# EAGLE design headstage-64-coax-adapter rev2.0 (EAGLE 9.5.1)
DESIGNER: Jon Newman; DESIGN_NAME: Headstage-64 Coax Adapter; LICENSE: CERN OHL v1.2; REVISION: 1.0
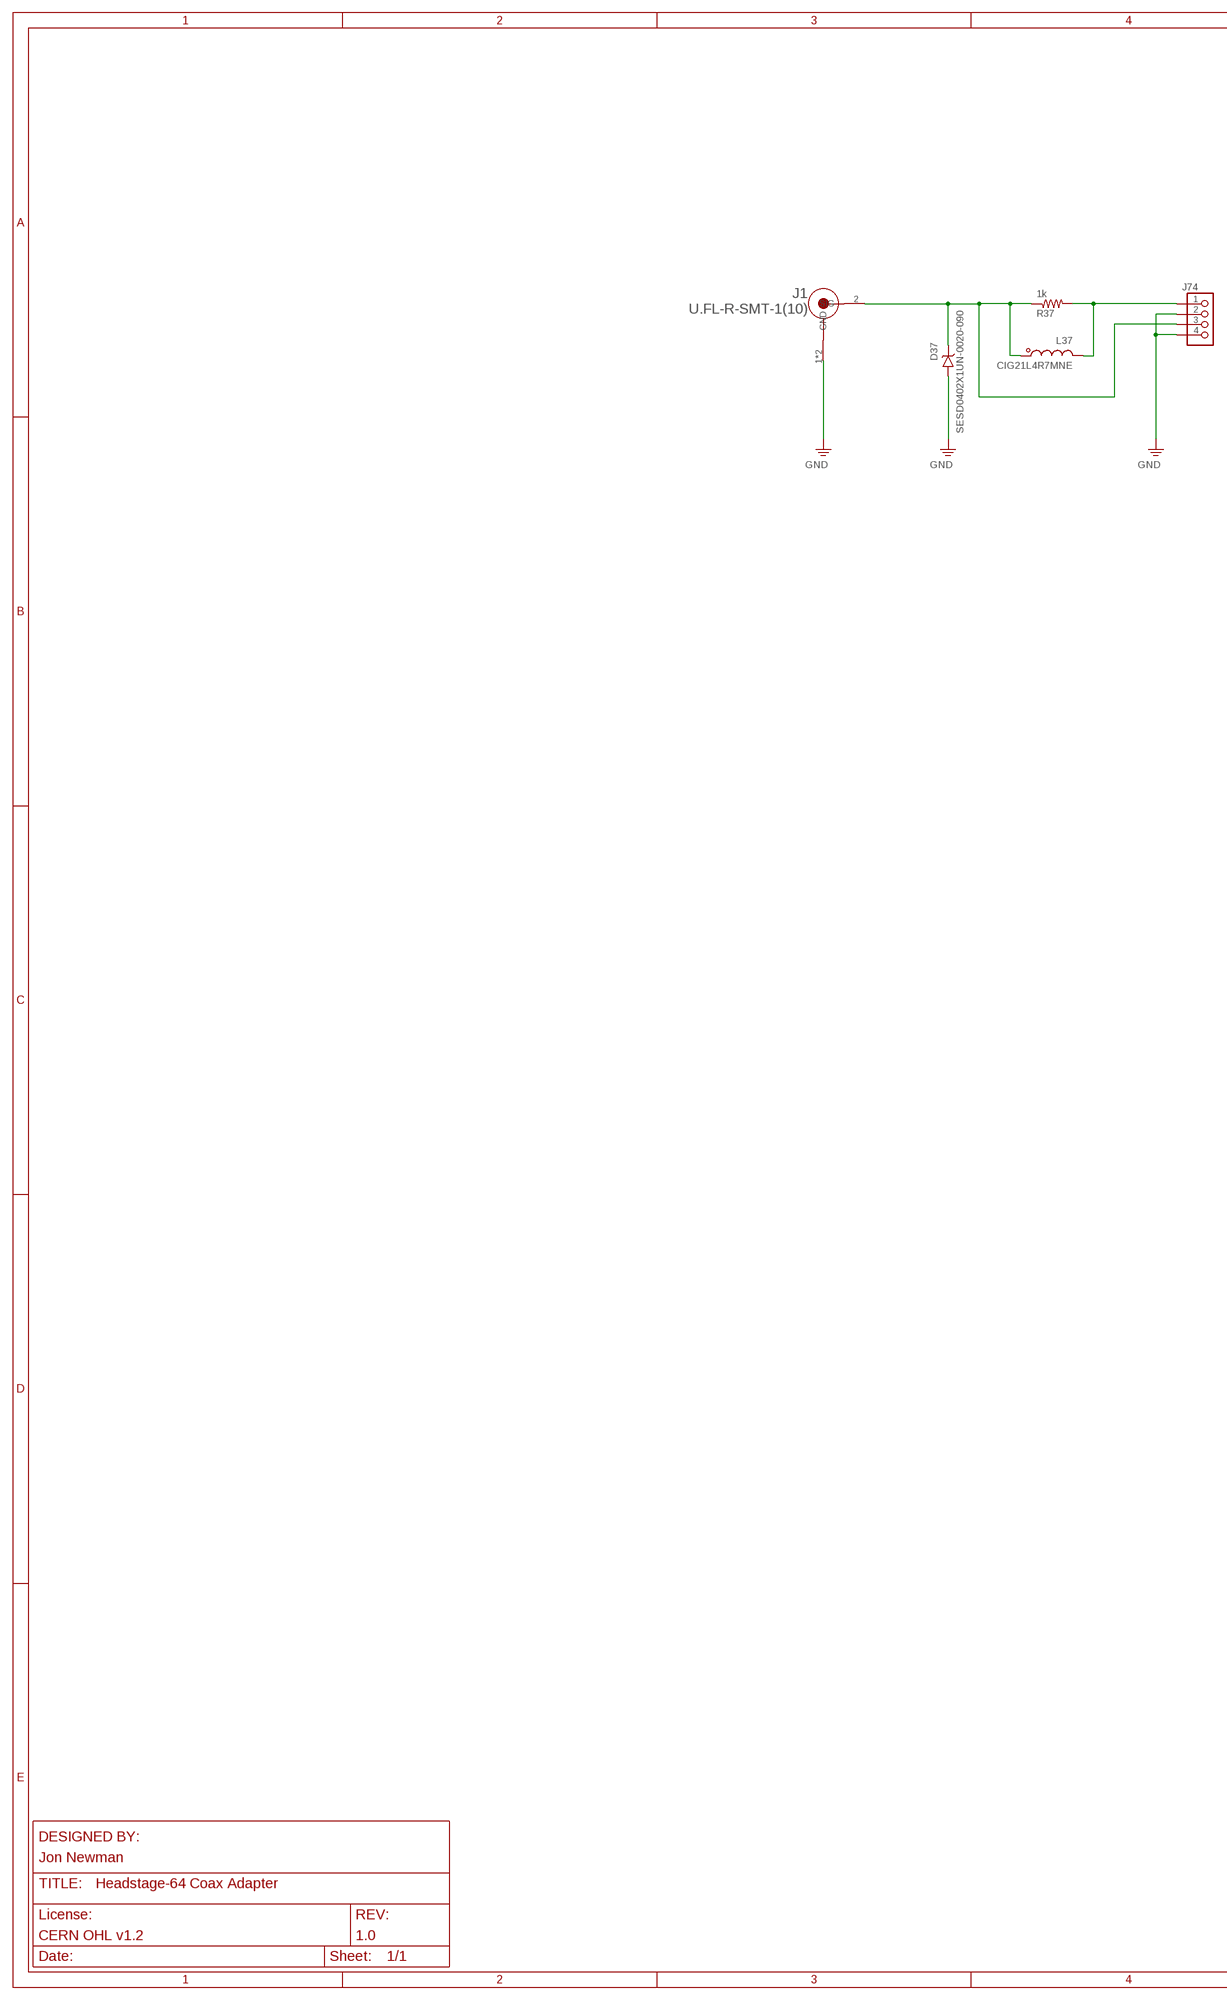
[diagram p0: schematic, sheet 1, part 1 of 2]
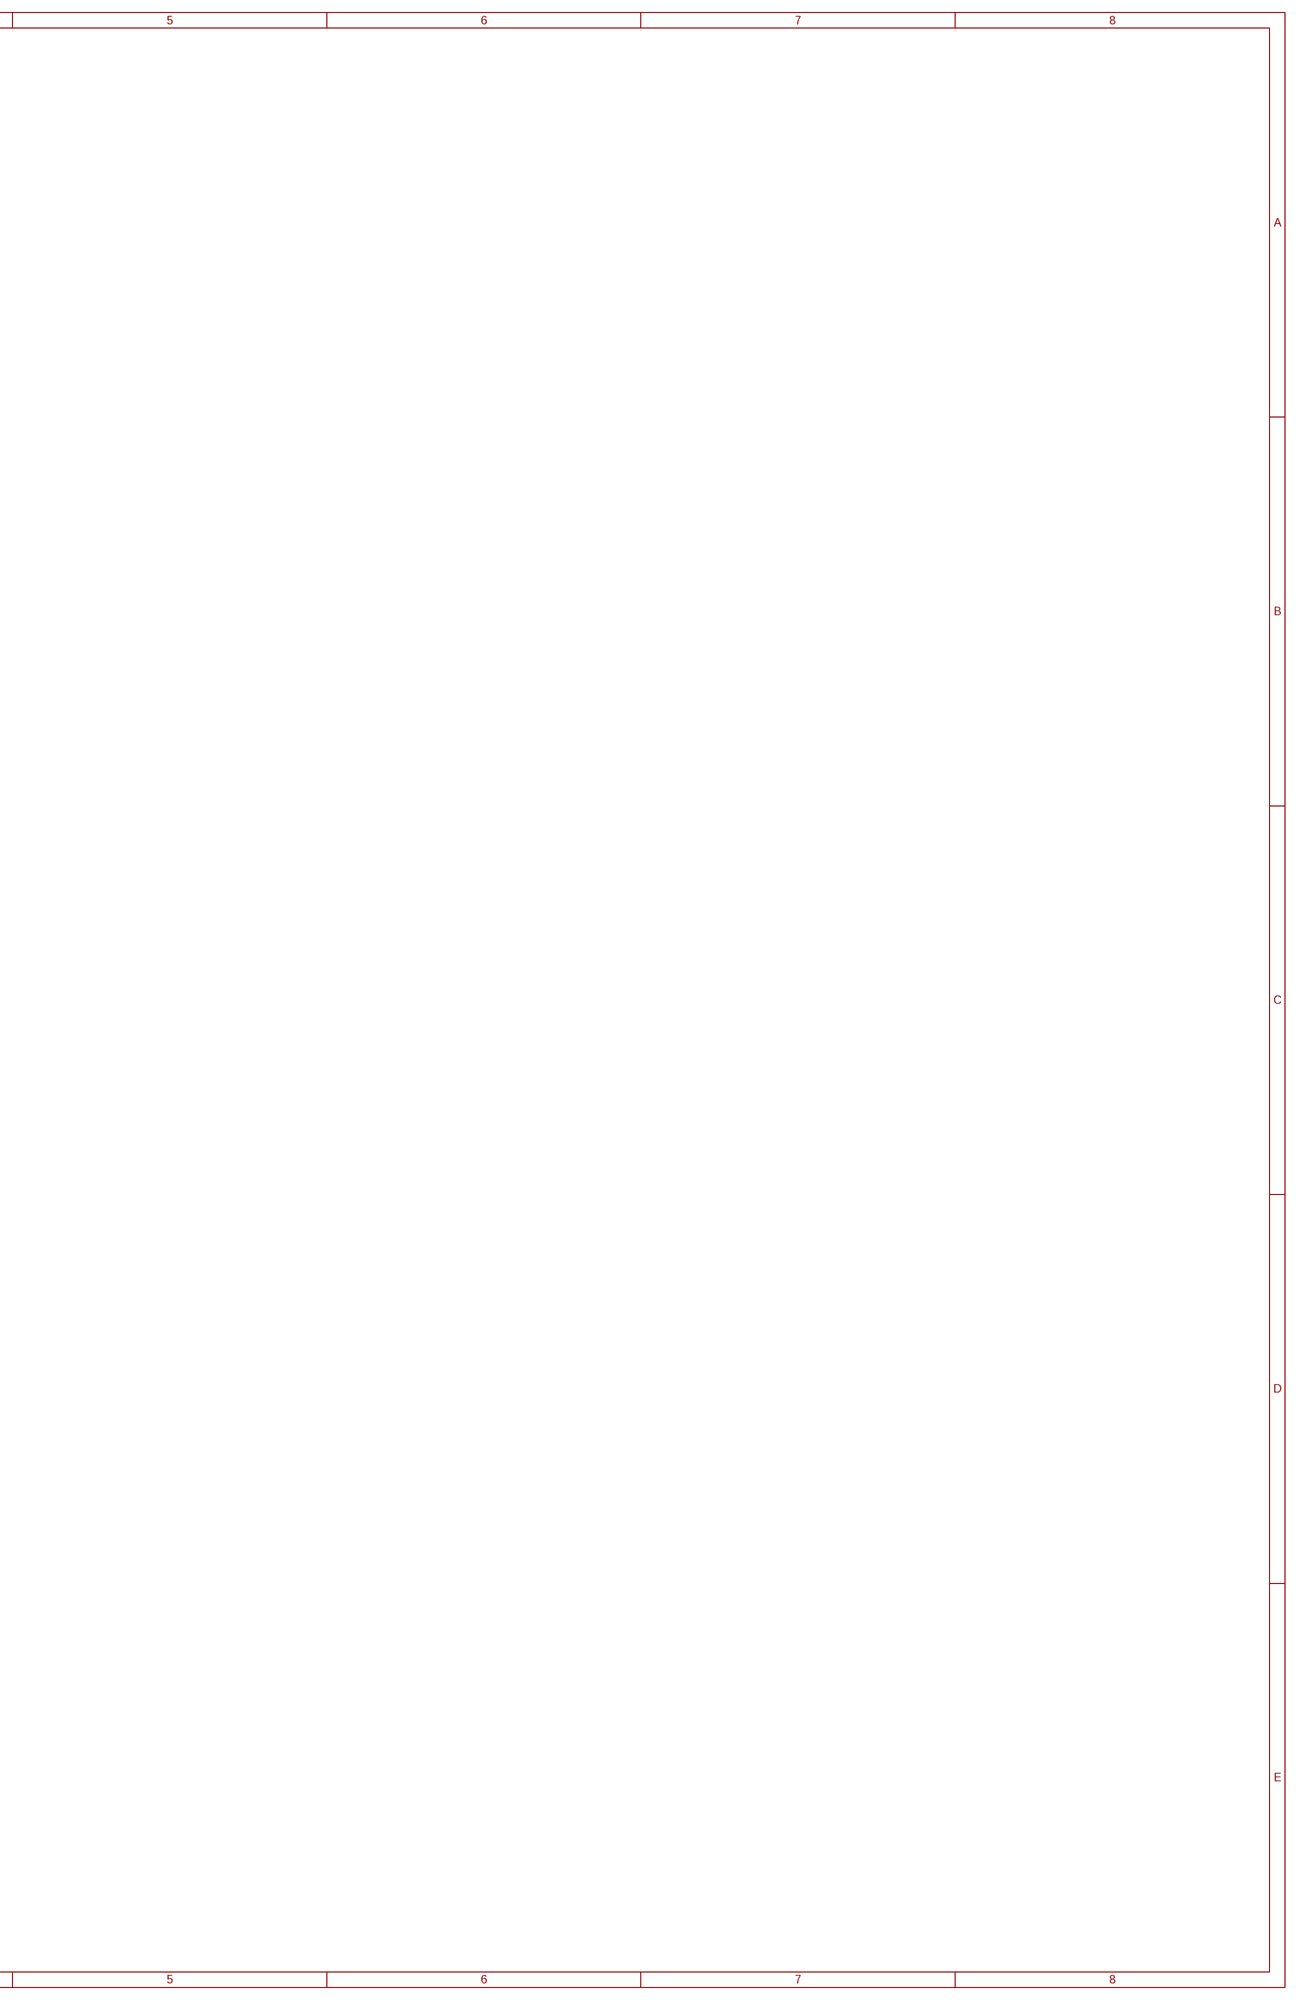
[diagram p1: schematic, sheet 1, part 2 of 2]

## Parts
D37  SESD0402X1UN-0020-090  Z-DIODE_0402T-DFN  [0402T-DFN]
J1  U.FL-R-SMT-1(10)  [HRS_U.FL-R-SMT-1(10)]
J74  PINHD-1X4HEADSTAGE64-DAUGHTER-CARD-CASTELLATED  [HEADSTAGE64-DAUGHER-CARD-CASTELLATED]
L37  CIG21L4R7MNE  L_0805T  [0805T]
R37  1k  R_0201T  [0201T]

## Nets
_SIGOUT37: D37.C J1.2(SIG) J74.3 L37.1 R37.1
GND: D37.A J1.1(GND) J1.3(GND) J74.2 J74.4
N$73: J74.1 L37.2 R37.2

## Library data of the parts
D37 = jonnew:Z-DIODE: Zener Diode
J1 = U.FL-R-SMT-1_10_:U.FL-R-SMT-1(10): U.FL, Ultra Miniature Coaxial Connector Receptacle, Male Pin 50 Ohm Surface Mount Solder Check availability <https://pricing.snapeda.com/parts/U.FL-R-SMT-1%2810%29/Hirose%20Electric%20Co%20Ltd/view-part?ref=eda>; AVAILABILITY: In Stock; DESCRIPTION: U.FL (UMCC) Connector Receptacle, Male Pin 50Ohm Surface Mount Solder; MF: Hirose Electric Co Ltd; MP: U.FL-R-SMT-1(10); PACKAGE: None; PRICE: None; PURCHASE-URL: https://pricing.snapeda.com/search/part/U.FL-R-SMT-1(10)/?ref=eda
J74 = jonnew:PINHD-1X4
L37 = jonnew:L: Inductor
R37 = jonnew:R: Resistor

## Board
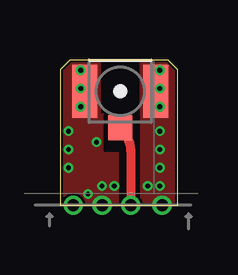
[diagram p2: board, top side]
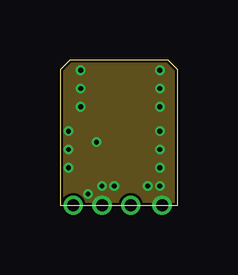
[diagram p3: board, inner layer Route2]
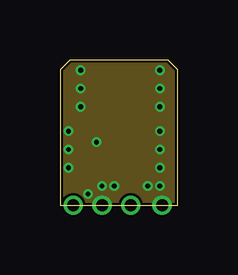
[diagram p4: board, inner layer Route15]
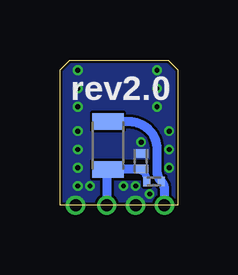
[diagram p5: board, bottom side, seen from below]

Size 4.9 x 6.05 mm. Coordinates in mm from the lower left corner, seen from the top.
Outline: 0,0 4.9,0 4.9,5.65 4.5,6.05 0.4,6.05 0,5.65 0,0
Copper layers (1*2*15*16): Top 0.035mm / dielectric 0.2mm / Route2 0.0175mm / dielectric 0.3mm / Route15 0.0175mm / dielectric 0.2mm / Bottom 0.035mm
Design rules "seeed-studio-4-layer *": minimum track width 4mil, minimum drill 0.2mm, track to track 4mil, track to pad 4mil, pad to pad 4mil, via to via 4mil, smd to smd 0mil, copper to edge 0.1mm, drill to drill 10mil, minimum pad ring 6mil, minimum via ring 4mil, stop-mask expansion 4mil, vias tented up to drill 100mil, thermal gap 10mil

### Footprints (pad centres in the part's own frame; a part is rotated, then mirrored left to right if it is on the bottom)
0402T-DFN = smd 0.35 x 0.6: A -0.325,0; C 0.325,0
HRS_U.FL-R-SMT-1(10) = smd 1.05 x 2.2: 1 -1.475,0; 3 1.475,0 | smd 1 x 1.05: 2 0,-1.525
HEADSTAGE64-DAUGHER-CARD-CASTELLATED = drill 0.5: 1 -2.4,0; 2 -1.2,0; 3 0,0; 4 1.3,0
0805T = smd 0.7 x 1.3: 1 -1,0; 2 1,0
0201T = smd 0.3 x 0.4: 1 -0.3,0; 2 0.3,0

### Placement (x,y rotation side)
D37  1.53,1.83 270 bottom
J1  2.51,4.75 0 top
J74  2.95,0 0 top
L37  2.9,2.49 90 bottom
R37  0.98,0.99 0 bottom

### Tracks (layer width: path | path; a pad name or v marks a point on that pad's centre or on a via)
_SIGOUT37
  Top 0.37: J1.2 arc-45 2.95,2.16 J74.3
  Bottom 0.3: 1.47,1.44 arc45 R37.1
  Bottom 0.37: J74.3 2.95,1.37 arc-45 L37.1 arc45 2.86,1.5 D37.C 1.47,1.44
GND  (via drill 0.2)
  other vias: 0.35,1.56 2.26,0.8 1.75,0.8 1.16,0.47 1.52,2.63 0.35,3.09 0.35,2.32 4.16,3.09 4.16,2.32 4.16,1.56 4.16,0.8 3.65,0.8 4.16,4.1 4.16,4.86 4.16,5.63 0.86,5.63 0.86,4.86 0.86,4.1
  pour Bottom (isolate 0.02, rank 2, no thermals): 0,6.05 4.9,6.05 4.9,0 0,0
  pour Route15 (isolate 0.02, rank 2, no thermals): 0,6.05 4.9,6.05 4.9,0 0,0
  pour Top (isolate 0.02, rank 2, no thermals): 0,6.05 4.9,6.05 4.9,0 0,0
  pour Route15 (isolate 0.02, rank 2, no thermals): 0,6.05 4.9,6.05 4.9,0 0,0
  pour Route2 (isolate 0.02, rank 2, no thermals): 0,6.05 4.9,6.05 4.9,0 0,0
N$73
  Bottom 0.37: J74.1 0.55,0.68 arc-45 R37.2 arc45 0.86,1.43 0.86,2.32 arc-90 2.03,3.49 L37.2
N$74
  cutout Top: 3.32,0.04 2.48,0.04 2.48,3.92 3.32,3.92
  cutout Bottom: 0.93,1.04 2.52,1.04 2.52,1.9 0.93,1.9
  cutout Top: 3.17,2.23 1.82,2.23 1.82,3.92 3.17,3.92

### Text on the board
bPlace: rev2.0